# Altium schematic sheet 13_USB3.1 Type-A x2 (B).SchDoc: C200
size 439 x 311 mm; Page Create Date: March  8, 1995; Page Number: 13; Page Size: Custom; Comment: radxa_1010; Page Count: 21; RevCode: V1.11; Doc: 13_USB3.1 Type-A x2 (B); DsnPath: D:\WMS\C200\CC122\对外\C200 V1.11.DSN; SchematicName: c200; PageName: 13_USB3.1 Type-A x2 (B); PageSize: Custom; TopSchematic: True
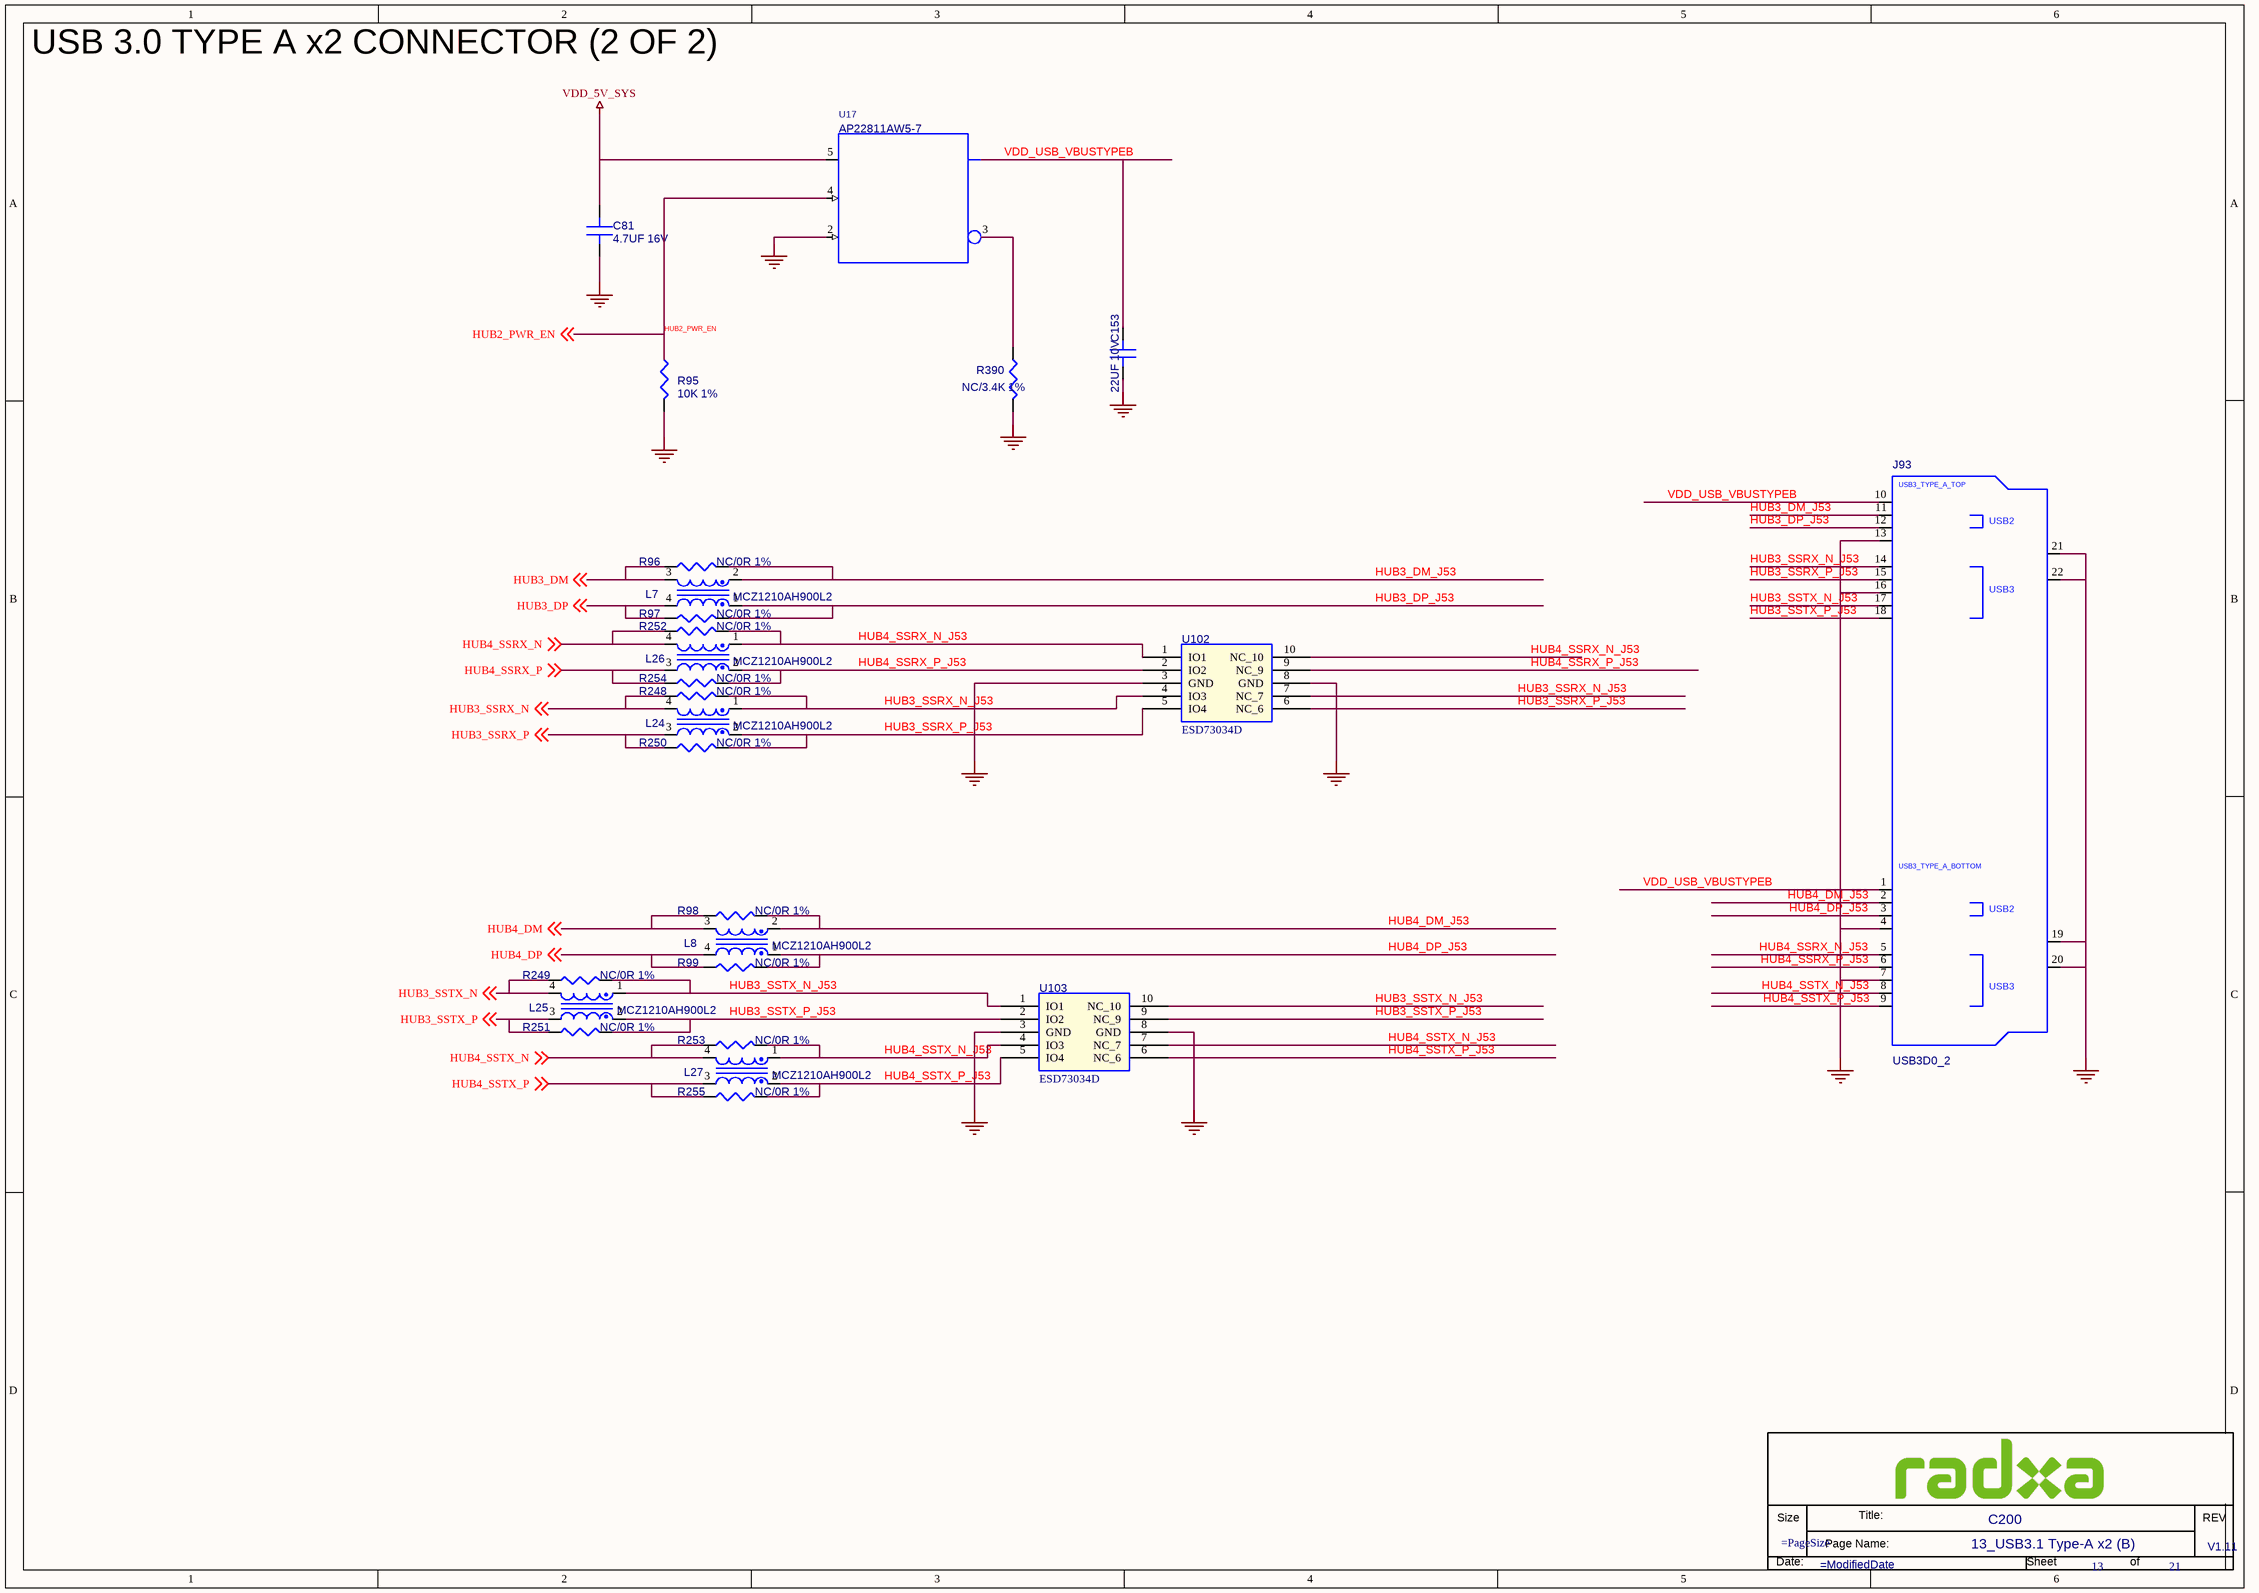
[diagram p0: 13_USB3.1 Type-A x2 (B).SchDoc]

## Parts
*  Doc: 13_USB3.1 Type-A x2 (B)  RevCode: V1.11  Title: C200  Page Number: 13  Page Count: 21  (hidden comment: radxa_1010)  (graphical)
C81  4.7UF 16V  [C0603]
C153  22UF 10V  [C0603]
J93  USB3D0_2  [USB3_TH18_17D0X14D0_LIE]
L7  MCZ1210AH900L2  [LC1210]
L8  MCZ1210AH900L2  [LC1210]
L24  MCZ1210AH900L2  [LC1210]
L25  MCZ1210AH900L2  [LC1210]
L26  MCZ1210AH900L2  [LC1210]
L27  MCZ1210AH900L2  [LC1210]
R95  10K 1%  [R0402]
R96  NC/0R 1%  [R0402]
R97  NC/0R 1%  [R0402]
R98  NC/0R 1%  [R0402]
R99  NC/0R 1%  [R0402]
R248  NC/0R 1%  [R0402]
R249  NC/0R 1%  [R0402]
R250  NC/0R 1%  [R0402]
R251  NC/0R 1%  [R0402]
R252  NC/0R 1%  [R0402]
R253  NC/0R 1%  [R0402]
R254  NC/0R 1%  [R0402]
R255  NC/0R 1%  [R0402]
R390  NC/3.4K 1%  [R0402]
U17  AP22811AW5-7  [SOT23_5]
U102  ESD73034D  [XSON10_0D5_1D1X2D6]
U103  ESD73034D  [XSON10_0D5_1D1X2D6]

## Nets
GND: C81.2(B) C153.2(B) J93.4(GND1) J93.7(GND2) J93.13(GND3) J93.16(GND4) J93.19(MT1) J93.20(MT2) J93.21(MT3) J93.22(MT4) R95.2 R390.1 U17.2(GND) U102.3(GND) U102.8(GND) U103.3(GND) U103.8(GND)
OUT: U17.1(OUT)
VDD_5V_SYS: C81.1(A) U17.5(IN)
HUB2_PWR_EN: R95.1 U17.4(EN) ; off-sheet HUB2_PWR_EN
HUB3_DM: L7.3 R96.1 ; off-sheet HUB3_DM
HUB3_DM_J53: J93.11(DN1) L7.2 R96.2
HUB3_DP: L7.4 R97.1 ; off-sheet HUB3_DP
HUB3_DP_J53: J93.12(DP1) L7.1 R97.2
HUB3_SSRX_N: L24.4 R248.1 ; off-sheet HUB3_SSRX_N
HUB3_SSRX_N_J53: J93.14(SSRXN1) L24.1 R248.2 U102.4(IO3) U102.7(NC_7)
HUB3_SSRX_P: L24.3 R250.1 ; off-sheet HUB3_SSRX_P
HUB3_SSRX_P_J53: J93.15(SSRXP1) L24.2 R250.2 U102.5(IO4) U102.6(NC_6)
HUB3_SSTX_N: L25.4 R249.1 ; off-sheet HUB3_SSTX_N
HUB3_SSTX_N_J53: J93.17(SSTXN1) L25.1 R249.2 U103.1(IO1) U103.10(NC_10)
HUB3_SSTX_P: L25.3 R251.1 ; off-sheet HUB3_SSTX_P
HUB3_SSTX_P_J53: J93.18(SSTXP1) L25.2 R251.2 U103.2(IO2) U103.9(NC_9)
HUB4_DM: L8.3 R98.1 ; off-sheet HUB4_DM
HUB4_DM_J53: J93.2(DN0) L8.2 R98.2
HUB4_DP: L8.4 R99.1 ; off-sheet HUB4_DP
HUB4_DP_J53: J93.3(DP0) L8.1 R99.2
HUB4_SSRX_N: L26.4 R252.1 ; off-sheet HUB4_SSRX_N
HUB4_SSRX_N_J53: J93.5(SSRXN0) L26.1 R252.2 U102.1(IO1) U102.10(NC_10)
HUB4_SSRX_P: L26.3 R254.1 ; off-sheet HUB4_SSRX_P
HUB4_SSRX_P_J53: J93.6(SSRXP0) L26.2 R254.2 U102.2(IO2) U102.9(NC_9)
HUB4_SSTX_N: L27.4 R253.1 ; off-sheet HUB4_SSTX_N
HUB4_SSTX_N_J53: J93.8(SSTXN0) L27.1 R253.2 U103.4(IO3) U103.7(NC_7)
HUB4_SSTX_P: L27.3 R255.1 ; off-sheet HUB4_SSTX_P
HUB4_SSTX_P_J53: J93.9(SSTXP0) L27.2 R255.2 U103.5(IO4) U103.6(NC_6)
VDD_USB_VBUSTYPEB: C153.1(A) J93.1(VBUS0) J93.10(VBUS1)
NetR390_2: R390.2 U17.3(OC*)

## Notes on the sheet
- USB 3.0 TYPE A x2 CONNECTOR (2 OF 2)
- (in symbol radxa_1010) Size; Title:; REV; Page Name:; Date:; Sheet; of
- (in symbol USB3D0_2) USB3_TYPE_A_TOP; USB2; USB3; USB3_TYPE_A_BOTTOM

## Library data of the parts
C81 = C: SMD  0603  4.7UF  16V  X5R  ±10%  ROHS; PARTS: 1; Part Reference: C81; Part Number: A1C01.00239; OriginalSymbolOrigin: (0,30); PKG_TYPE: CAP2-100-250; LEVEL: STD; PINSWAP: (A,B); Value: 4.7UF 16V; Part Type: 陶瓷电容; PCB Footprint: C0603
C153 = C: SMD  0603  22UF  10V  X5R  ±10%  ROHS; PARTS: 1; Part Reference: C153; Part Number: A1C01.00296; OriginalSymbolOrigin: (0,30); PKG_TYPE: CAP2-100-250; LEVEL: STD; PINSWAP: (A,B); Value: 22UF 10V; Part Type: 陶瓷电容; PCB Footprint: C0603
J93 = USB3D0_2: DIP  USB3.0母座  双层  卷边无定位柱  蓝色胶芯  17.5*14.5*H15.5mm  90度弯脚  弯脚固定间距15.6mm  不锈钢  WLUS-096H  兆联  ROHS; Part Reference: J93; Part Number: A1J08.00040; OriginalSymbolOrigin: (-300,1100); SKU: COMMON; SHROUDED: ?; SHIELDED: ?; REFLOW: ?; PLACEMENT_NOTE: ?; PITCH: ?; PATH: ?; PACK_TYPE: ?; NV_PN: ?; NV_NAME: ?; MAX_VOLTAGE: ?; MAX_CURRENT: ?; LATCHING: ?; GENDER: ?; EMI_GROUND_TAB: ?; ASSEMBLY: ?; ANGLE: ?; Value: USB3D0_2; Part Type: USB座; PCB Footprint: USB3_TH18_17D0X14D0_LIE
L7 = MCZ1210AH900L2: SMD  MCZ1210AH900L2TA0G  90R  4PIN  TDK  ROHS; Part Reference: L7; Part Number: A1L03.00007; PCB Footprint: LC1210; Value: MCZ1210AH900L2; Part Type: 共模电感
L8 = MCZ1210AH900L2: SMD  MCZ1210AH900L2TA0G  90R  4PIN  TDK  ROHS; Part Reference: L8; Part Number: A1L03.00007; PCB Footprint: LC1210; Value: MCZ1210AH900L2; Part Type: 共模电感
L24 = MCZ1210AH900L2: SMD  MCZ1210AH900L2TA0G  90R  4PIN  TDK  ROHS; Part Reference: L24; Part Number: A1L03.00007; PCB Footprint: LC1210; Value: MCZ1210AH900L2; Part Type: 共模电感
L25 = MCZ1210AH900L2: SMD  MCZ1210AH900L2TA0G  90R  4PIN  TDK  ROHS; Part Reference: L25; Part Number: A1L03.00007; PCB Footprint: LC1210; Value: MCZ1210AH900L2; Part Type: 共模电感
L26 = MCZ1210AH900L2: SMD  MCZ1210AH900L2TA0G  90R  4PIN  TDK  ROHS; Part Reference: L26; Part Number: A1L03.00007; PCB Footprint: LC1210; Value: MCZ1210AH900L2; Part Type: 共模电感
L27 = MCZ1210AH900L2: SMD  MCZ1210AH900L2TA0G  90R  4PIN  TDK  ROHS; Part Reference: L27; Part Number: A1L03.00007; PCB Footprint: LC1210; Value: MCZ1210AH900L2; Part Type: 共模电感
R95 = R: SMD  0402  10K  1/16W  ±1%  ROHS; Part Reference: R95; CDS_PHYS_PART_NAME: R_0402-10K,5 %,62.5MW,195-0486-000-10K,195-0486-000; CDS_PART_NAME: R_0402-10K,5 %,62.5MW,195-0486-000; Part Number: A1R01.00222; SEC: 1; XY: (-7750,6150); VER: 2; TOL: 5%; SIGNAL_MODEL: nv_res; ROT: 0; PHYS_PAGE: 14; PATH: I42; PACK_TYPE: 402; NV_PN: 195-0486-000; MAX_WATTAGE: 62.5mW; DRAWING: #NAME?; DEVICE_TYPENAME: R_0402-10K5625MW195-0486-000-10K195-0486-000; CDS_LIB: discrete; ASSEMBLY: USB3_TYPEA; PCB Footprint: R0402; Value: 10K 1%; CHIPS_PART_NAME: R; CDS_SEC: 1; Part Type: 贴片电阻
R96 = R: SMD  0402  0R  1/16W  ±1%  ROHS; Part Reference: R96; Part Number: A1R01.00219; PCB Footprint: R0402; Value: NC/0R 1%; Part Type: 贴片电阻
R97 = R: SMD  0402  0R  1/16W  ±1%  ROHS; Part Reference: R97; Part Number: A1R01.00219; PCB Footprint: R0402; Value: NC/0R 1%; Part Type: 贴片电阻
R98 = R: SMD  0402  0R  1/16W  ±1%  ROHS; Part Reference: R98; Part Number: A1R01.00219; PCB Footprint: R0402; Value: NC/0R 1%; Part Type: 贴片电阻
R99 = R: SMD  0402  0R  1/16W  ±1%  ROHS; Part Reference: R99; Part Number: A1R01.00219; PCB Footprint: R0402; Value: NC/0R 1%; Part Type: 贴片电阻
R248 = R: SMD  0402  0R  1/16W  ±1%  ROHS; Part Reference: R248; Part Number: A1R01.00219; PCB Footprint: R0402; Value: NC/0R 1%; Part Type: 贴片电阻
R249 = R: SMD  0402  0R  1/16W  ±1%  ROHS; Part Reference: R249; Part Number: A1R01.00219; PCB Footprint: R0402; Value: NC/0R 1%; Part Type: 贴片电阻
R250 = R: SMD  0402  0R  1/16W  ±1%  ROHS; Part Reference: R250; Part Number: A1R01.00219; PCB Footprint: R0402; Value: NC/0R 1%; Part Type: 贴片电阻
R251 = R: SMD  0402  0R  1/16W  ±1%  ROHS; Part Reference: R251; Part Number: A1R01.00219; PCB Footprint: R0402; Value: NC/0R 1%; Part Type: 贴片电阻
R252 = R: SMD  0402  0R  1/16W  ±1%  ROHS; Part Reference: R252; Part Number: A1R01.00219; PCB Footprint: R0402; Value: NC/0R 1%; Part Type: 贴片电阻
R253 = R: SMD  0402  0R  1/16W  ±1%  ROHS; Part Reference: R253; Part Number: A1R01.00219; PCB Footprint: R0402; Value: NC/0R 1%; Part Type: 贴片电阻
R254 = R: SMD  0402  0R  1/16W  ±1%  ROHS; Part Reference: R254; Part Number: A1R01.00219; PCB Footprint: R0402; Value: NC/0R 1%; Part Type: 贴片电阻
R255 = R: SMD  0402  0R  1/16W  ±1%  ROHS; Part Reference: R255; Part Number: A1R01.00219; PCB Footprint: R0402; Value: NC/0R 1%; Part Type: 贴片电阻
R390 = R: SMD  0402  3.4K  1/16W  ±1%  ROHS; Part Reference: R390; Part Number: A1R01.00506; PCB Footprint: R0402; Value: NC/3.4K 1%; Part Type: 贴片电阻
U17 = AP22811AW5-7: SMD  功率电子开关  AP22811AW5-7  2A;2.7V~5.5V,Active High  SOT23_5  DIODES(美台)  ROHS; Part Reference: U17; Part Number: A1I01.00763; OriginalSymbolOrigin: (-250,250); Temp Coeff: -40℃~85℃; ASSEMBLY: ?; MAX_CURRENT: ?; MAX_VOLTAGE: ?; NV_NAME: ?; NV_PN: ?; OUTPUT_VOLTAGE: ?; PACK_TYPE: ?; PATH: ?; PLACEMENT_NOTE: ?; SKU: COMMON; TYPE: ?; Value: AP22811AW5-7; Part Type: 集成电路/模块; PCB Footprint: SOT23_5
U102 = ESD73034D: SMD  编带  SON10  ESD73034D-10/TR  4Line 双向TVS  VRWM=3.3V  0.2pF  33W  WILLSEMI(韦尔)  ROHS; Part Reference: U102; Part Number: A1D02.00015; Parameter: ESD-ESD73034D-封装 SON10_2R50X1R00X0R50; PCB Footprint: XSON10_0D5_1D1X2D6; Value: ESD73034D; Part Type: 二极管-ESD管-桥堆-TVS管
U103 = ESD73034D: SMD  编带  SON10  ESD73034D-10/TR  4Line 双向TVS  VRWM=3.3V  0.2pF  33W  WILLSEMI(韦尔)  ROHS; Part Reference: U103; Part Number: A1D02.00015; Parameter: ESD-ESD73034D-封装 SON10_2R50X1R00X0R50; PCB Footprint: XSON10_0D5_1D1X2D6; Value: ESD73034D; Part Type: 二极管-ESD管-桥堆-TVS管
* = radxa_1010: Page Create Date: March  8, 1995; Page Size: =PageSize; Page Modify Date: =ModifiedDate